# Altium project KMP-Watermeter.PrjPcb
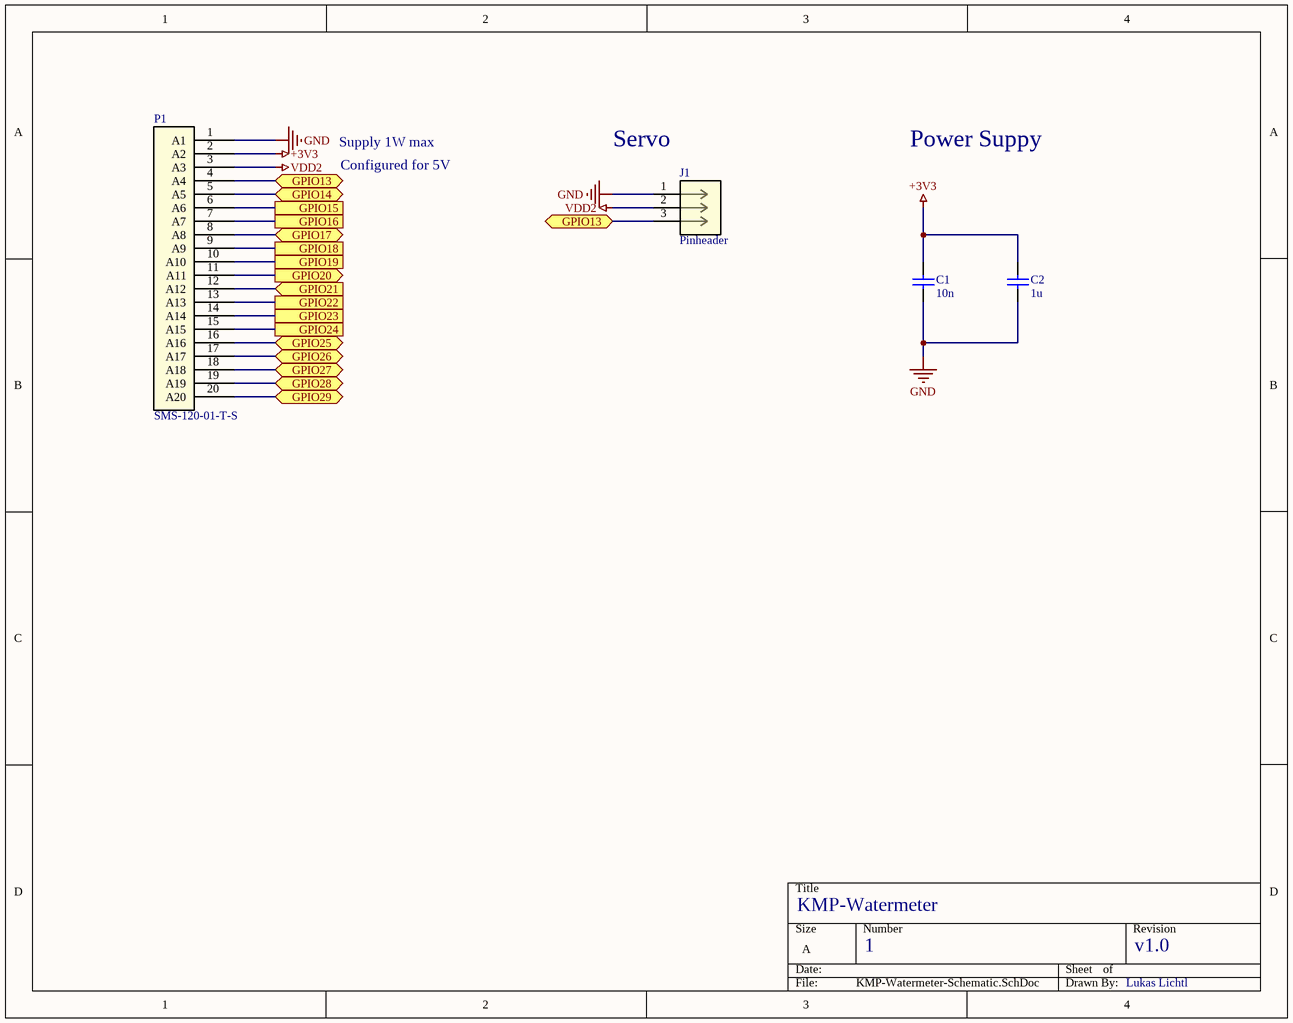
[diagram p0: KMP-Watermeter-Schematic.SchDoc]
3 sheets, 17 parts. Net scope: flat (ports and power ports of the same name join across sheets).
Board file: KMP-Watermeter-PCB.PcbDoc
Sheets:
  KMP-Watermeter-Schematic.SchDoc
  Receiver.SchDoc
  Transmitter.SchDoc

## Sheet KMP-Watermeter-Schematic.SchDoc
size A; SheetNumber: 1

### Parts
C1  10n  [CAPC1608X90X35LL15T15]
C2  1u  [CAPC1608X90X35LL15T15]
J1  Pinheader  [CONN03_6130_7P62X2P54_WRE]
P1  SMS-120-01-T-S  [SMS-S-120]

### Ports
GPIO13 (bidir), GPIO14 (bidir), GPIO15, GPIO16, GPIO17 (bidir), GPIO18, GPIO19, GPIO20 (out), GPIO21 (in), GPIO22, GPIO23, GPIO24, GPIO25 (bidir), GPIO26 (bidir), GPIO27 (bidir), GPIO28 (bidir), GPIO29 (bidir)

### Nets
+3V3: C1.2 C2.2 P1.2(A2)
GND: C1.1 C2.1 J1.1 P1.1(A1)
VDD2: J1.2 P1.3(A3)
NetJ1_3: J1.3 P1.4(A4) ; port GPIO13
NetP1_5: P1.5(A5) ; port GPIO14
NetP1_6: P1.6(A6) ; port GPIO15
NetP1_7: P1.7(A7) ; port GPIO16
NetP1_8: P1.8(A8) ; port GPIO17
NetP1_9: P1.9(A9) ; port GPIO18
NetP1_10: P1.10(A10) ; port GPIO19
NetP1_11: P1.11(A11) ; port GPIO20
NetP1_12: P1.12(A12) ; port GPIO21
NetP1_13: P1.13(A13) ; port GPIO22
NetP1_14: P1.14(A14) ; port GPIO23
NetP1_15: P1.15(A15) ; port GPIO24
NetP1_16: P1.16(A16) ; port GPIO25
NetP1_17: P1.17(A17) ; port GPIO26
NetP1_18: P1.18(A18) ; port GPIO27
NetP1_19: P1.19(A19) ; port GPIO28
NetP1_20: P1.20(A20) ; port GPIO29

### Notes on the sheet
- Supply 1W max
- (near J1) Servo
- Power Suppy
- Configured for 5V
- KMP-Watermeter
- 1
- v1.0
- Lukas Lichtl

### Library data of the parts
C1 C2 = CMP-2006-02133-1: Manufacturer: AVX Interconnect / Elco; Part Number: 0603ZC101KAT2A
J1 = 61300311121: WR-PHD 2.54 mm Pin Header; Manufacturer_Name: Wurth Electronics; Copyright: Copyright (C) 2026 Ultra Librarian. All rights reserved.; Manufacturer_Part_Number: 61300311121; RefDes: RefDes; Type: Type
P1 = SMS-120-01-T-S: No Description Available; Mfr_Name: Samtec Inc; RefDes: RefDes; Type: Type

## Sheet Receiver.SchDoc
size A
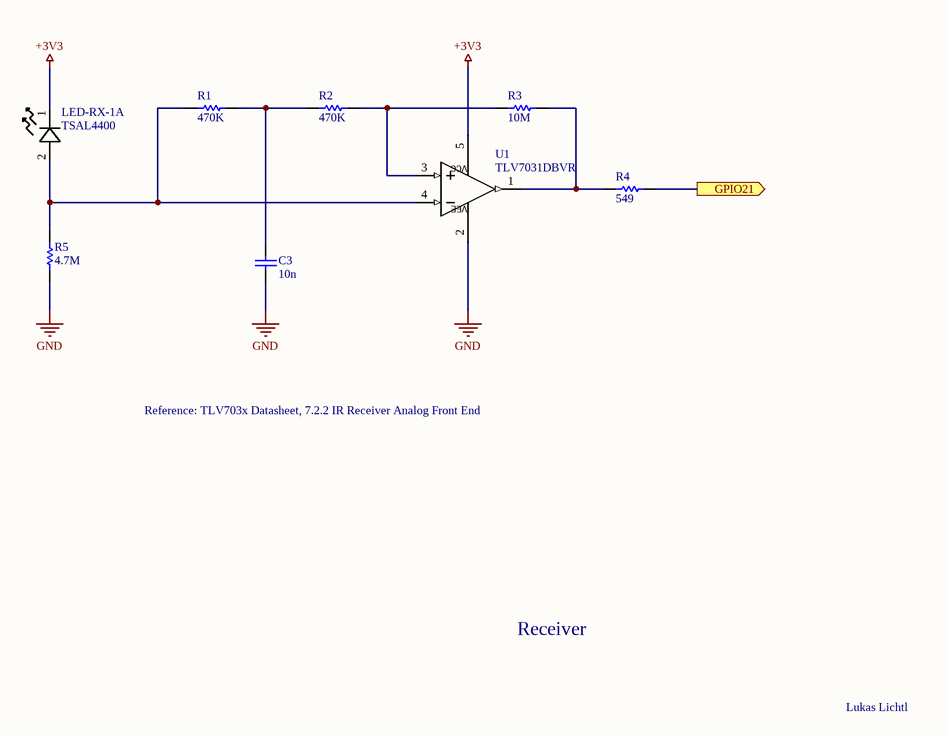
[diagram p1: Receiver.SchDoc]

### Parts
C3  10n  [CAPC1608X90X35LL15T15]
LED-RX-1  TSAL4400  [LED_RADIAL_TSAL4400]  (part A of 4)
R1  470K  [RESC1608X55X25NL10T15]
R2  470K  [RESC1608X55X25NL10T15]
R3  10M  [RESC1608X55X25NL10T15]
R4  549  [RESC1608X55X25NL10T15]
R5  4.7M  [RESC1608X55X25NL10T15]
U1  TLV7031DBVR  [DBV0005A_N]

### Ports
GPIO21 (out)

### Nets
+3V3: LED-RX-1.1(CAHTODE) U1.5(VCC)
GND: C3.1 R5.2 U1.2(VEE)
NetC3_2: C3.2 R1.2 R2.1
NetLED-RX-1_2: LED-RX-1.2(ANODE) R1.1 R5.1 U1.4(IN-)
NetP1_12: R4.2 ; port GPIO21
NetR2_2: R2.2 R3.1 U1.3(IN+)
NetR3_2: R3.2 R4.1 U1.1(OUT)

### Notes on the sheet
- Reference: TLV703x Datasheet, 7.2.2 IR Receiver Analog Front End
- Receiver
- Lukas Lichtl

### Library data of the parts
C3 = CMP-2006-02133-1: as C1 on sheet KMP-Watermeter-Schematic
LED-RX-1 = TSAL4400: Description; Manufacturer_Name: Vishay Semiconductors; Type: LED Indication; Copyright: Copyright (C) 2025 Ultra Librarian. All rights reserved.; Manufacturer_Part_Number: TSAL4400
R1-R5 = CMP-2000-04082-1: Manufacturer: Yageo; Part Number: RC0603FR-07549RL
U1 = TLV7031DBVR: Nanopower, small size comparator with push-pull output 5-SOT-23 -40 to 125; Manufacturer_Name: Texas Instruments; TYPE: TYPE; RefDes: RefDes; Copyright: Copyright (C) 2026 Ultra Librarian. All rights reserved.; Manufacturer_Part_Number: TLV7031DBVR

## Sheet Transmitter.SchDoc
size A
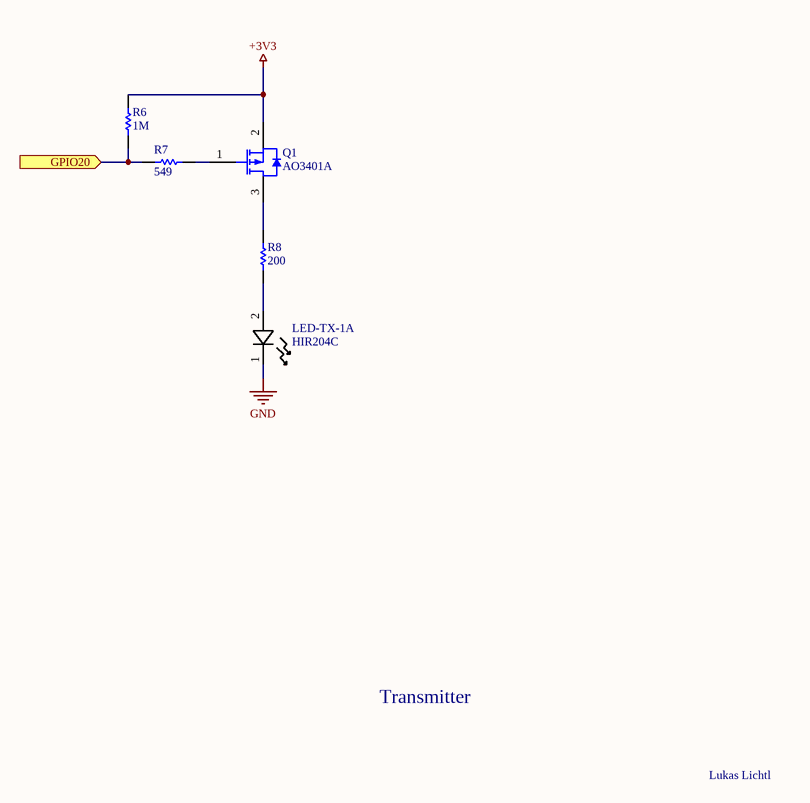
[diagram p2: Transmitter.SchDoc]

### Parts
LED-TX-1  HIR204C  [LED_RADIAL_HIR204C]  (part A of 4)
Q1  AO3401A  [AO-SOT-23-3L_V]
R6  1M  [RESC1608X55X25NL10T15]
R7  549  [RESC1608X55X25NL10T15]
R8  200  [RESC1608X55X25NL10T15]

### Ports
GPIO20 (in)

### Nets
+3V3: Q1.2(SOURCE) R6.2
GND: LED-TX-1.1(CAHTODE)
NetLED-TX-1_2: LED-TX-1.2(ANODE) R8.1
NetP1_11: R6.1 R7.1 ; port GPIO20
NetQ1_1: Q1.1(GATE) R7.2
NetQ1_3: Q1.3(DRAIN) R8.2

### Notes on the sheet
- Transmitter
- Lukas Lichtl

### Library data of the parts
LED-TX-1 = HIR204C: Description; Manufacturer_Name: Everlight; Type: LED Indication; Copyright: Copyright (C) 2025 Ultra Librarian. All rights reserved.; Manufacturer_Part_Number: HIR204C
Q1 = CMP-2000-05778-1: P-Channel MOSFET, 30 V, 4 A, -55 to 150 degC, 3-Pin SOT-23-3L, RoHS, Tape and Reel; Manufacturer: Alpha and Omega; Output Power (Max): NotRequiredW; Power Dissipation: 1.4W; Rad Hardened: No; Drain Efficiency: NotRequired%; Drain-Source On-Volt: 30V; Noise Figure: NotRequireddB; Frequency (Max): NotRequiredMHz; Number of  Elements: 1; Gate-Source Voltage (Max): ?12V; Drain Current (Max): 4A; Channel Mode: Enhancement; Drain-Source On-Res: 0.044ohm; Type: PowerMOSFET; Polarity: P; Package URL: http://www.aosmd.com/res/packaging_information/SOT-23-3L.pdf; Datasheet URL: http://www.aosmd.com/res/data_sheets/AO3401A.pdf; Package Type: SOT-23; Package Description: 3-Pin Small Outline Transistor, Body 2.95 x 1.6 mm, Pitch 0.95 mm; Mounting: SurfaceMount; Manufacturer URL: http://www.aosmd.com/; Continuous Drain Current: 4A; Package Reference: SOT-23-3L; Mounting Technology: SurfaceMount; Operating Temperature Classification: Military; Power Gain: NotRequireddB; Datasheet Version: Rev. 3, 03/2011; Operating Temp Range: -55Cto150C; Pin Count: 3
R6-R8 = CMP-2000-04082-1: as R1 on sheet Receiver

## Nets that join several sheets
+3V3: KMP-Watermeter-Schematic (C1.2 C2.2 P1.2), Receiver (LED-RX-1.1 U1.5), Transmitter (Q1.2 R6.2)
GND: KMP-Watermeter-Schematic (C1.1 C2.1 J1.1 P1.1), Receiver (C3.1 R5.2 U1.2), Transmitter (LED-TX-1.1)
NetP1_11: KMP-Watermeter-Schematic (P1.11), Transmitter (R6.1 R7.1)
NetP1_12: KMP-Watermeter-Schematic (P1.12), Receiver (R4.2)